# Altium schematic sheet Opamp_AH.SchDoc
size A4; CompanyName: Technische Hochschule Nürnberg Georg Simon Ohm; Organization: UltraZohm; Address1: Kesslerplatz 12; Address2: 90489 Nürnberg; Address3: GERMANY; DocumentNumber: 5; SheetNumber: 5; SheetTotal: 12; Website: www.ultrazohm.com
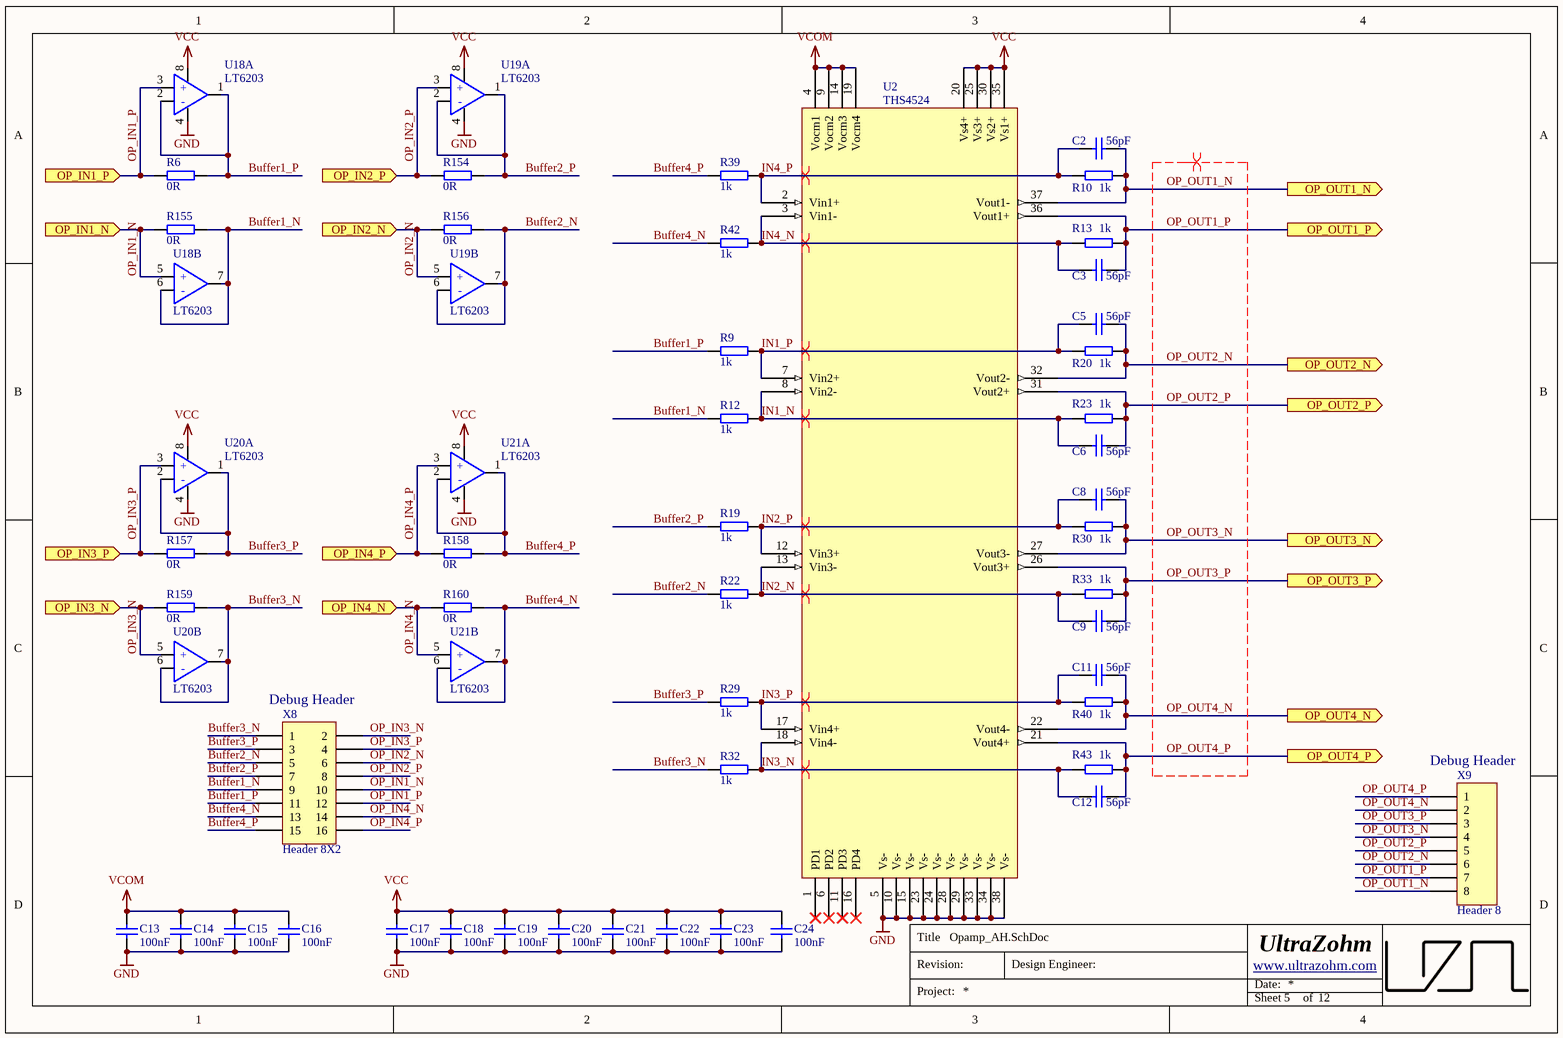
[diagram p0: Opamp_AH.SchDoc]

## Parts
C2  56pF  [CAPC1608X07N]
C3  56pF  [CAPC1608X07N]
C5  56pF  [CAPC1608X07N]
C6  56pF  [CAPC1608X07N]
C8  56pF  [CAPC1608X07N]
C9  56pF  [CAPC1608X07N]
C11  56pF  [CAPC1608X07N]
C12  56pF  [CAPC1608X07N]
C13  100nF  [CAPC1608X07N]
C14  100nF  [CAPC1608X07N]
C15  100nF  [CAPC1608X07N]
C16  100nF  [CAPC1608X07N]
C17  100nF  [CAPC1608X07N]
C18  100nF  [CAPC1608X07N]
C19  100nF  [CAPC1608X07N]
C20  100nF  [CAPC1608X07N]
C21  100nF  [CAPC1608X07N]
C22  100nF  [CAPC1608X07N]
C23  100nF  [CAPC1608X07N]
C24  100nF  [CAPC1608X07N]
R6  0R  [RESC1608X06N]
R9  1k  [RESC1608X06N]
R10  1k  [RESC1608X06N]
R12  1k  [RESC1608X06N]
R13  1k  [RESC1608X06N]
R19  1k  [RESC1608X06N]
R20  1k  [RESC1608X06N]
R22  1k  [RESC1608X06N]
R23  1k  [RESC1608X06N]
R29  1k  [RESC1608X06N]
R30  1k  [RESC1608X06N]
R32  1k  [RESC1608X06N]
R33  1k  [RESC1608X06N]
R39  1k  [RESC1608X06N]
R40  1k  [RESC1608X06N]
R42  1k  [RESC1608X06N]
R43  1k  [RESC1608X06N]
R154  0R  [RESC1608X06N]
R155  0R  [RESC1608X06N]
R156  0R  [RESC1608X06N]
R157  0R  [RESC1608X06N]
R158  0R  [RESC1608X06N]
R159  0R  [RESC1608X06N]
R160  0R  [RESC1608X06N]
U2  THS4524  [TSSOP38]
U18  LT6203  [8-MSOP]  (parts A,B of 2)
U19  LT6203  [8-MSOP]  (parts A,B of 2)
U20  LT6203  [8-MSOP]  (parts A,B of 2)
U21  LT6203  [8-MSOP]  (parts A,B of 2)
X8  Header 8X2  [HDR2X8]
X9  Header 8  [HDR1X8]

## Ports
OP_IN1_N (in), OP_IN1_P (in), OP_IN2_N (in), OP_IN2_P (in), OP_IN3_N (in), OP_IN3_P (in), OP_IN4_N (in), OP_IN4_P (in), OP_OUT1_N (out), OP_OUT1_P (out), OP_OUT2_N (out), OP_OUT2_P (out), OP_OUT3_N (out), OP_OUT3_P (out), OP_OUT4_N (out), OP_OUT4_P (out)

## Nets
GND: C13.2 C14.2 C15.2 C16.2 C17.2 C18.2 C19.2 C20.2 C21.2 C22.2 C23.2 C24.2 U2.5(Vs-) U2.10(Vs-) U2.15(Vs-) U2.23(Vs-) U2.24(Vs-) U2.28(Vs-) U2.29(Vs-) U2.33(Vs-) U2.34(Vs-) U2.38(Vs-) U18.4 U19.4 U20.4 U21.4
VCC: C17.1 C18.1 C19.1 C20.1 C21.1 C22.1 C23.1 C24.1 U2.20(Vs4+) U2.25(Vs3+) U2.30(Vs2+) U2.35(Vs1+) U18.8 U19.8 U20.8 U21.8
VCOM: C13.1 C14.1 C15.1 C16.1 U2.4(Vocm1) U2.9(Vocm2) U2.14(Vocm3) U2.19(Vocm4)
Buffer1_N: R12.2 R155.2 U18.6(-) U18.7 X8.9
Buffer1_P: R6.2 R9.1 U18.1 U18.2(-) X8.11
Buffer2_N: R22.2 R156.2 U19.6(-) U19.7 X8.5
Buffer2_P: R19.1 R154.2 U19.1 U19.2(-) X8.7
Buffer3_N: R32.2 R159.2 U20.6(-) U20.7 X8.1
Buffer3_P: R29.1 R157.2 U20.1 U20.2(-) X8.3
Buffer4_N: R42.2 R160.2 U21.6(-) U21.7 X8.13
Buffer4_P: R39.1 R158.2 U21.1 U21.2(-) X8.15
IN1_N: C6.1 R12.1 R23.1 U2.8(Vin2-)
IN1_P: C5.1 R9.2 R20.1 U2.7(Vin2+)
IN2_N: C9.1 R22.1 R33.1 U2.13(Vin3-)
IN2_P: C8.1 R19.2 R30.1 U2.12(Vin3+)
IN3_N: C12.1 R32.1 R43.1 U2.18(Vin4-)
IN3_P: C11.1 R29.2 R40.1 U2.17(Vin4+)
IN4_N: C3.1 R13.1 R42.1 U2.3(Vin1-)
IN4_P: C2.1 R10.1 R39.2 U2.2(Vin1+)
OP_IN1_N: R155.1 U18.5(+) X8.10 ; port OP_IN1_N
OP_IN1_P: R6.1 U18.3(+) X8.12 ; port OP_IN1_P
OP_IN2_N: R156.1 U19.5(+) X8.6 ; port OP_IN2_N
OP_IN2_P: R154.1 U19.3(+) X8.8 ; port OP_IN2_P
OP_IN3_N: R159.1 U20.5(+) X8.2 ; port OP_IN3_N
OP_IN3_P: R157.1 U20.3(+) X8.4 ; port OP_IN3_P
OP_IN4_N: R160.1 U21.5(+) X8.14 ; port OP_IN4_N
OP_IN4_P: R158.1 U21.3(+) X8.16 ; port OP_IN4_P
OP_OUT1_N: C2.2 R10.2 U2.37(Vout1-) X9.8 ; port OP_OUT1_N
OP_OUT1_P: C3.2 R13.2 U2.36(Vout1+) X9.7 ; port OP_OUT1_P
OP_OUT2_N: C5.2 R20.2 U2.32(Vout2-) X9.6 ; port OP_OUT2_N
OP_OUT2_P: C6.2 R23.2 U2.31(Vout2+) X9.5 ; port OP_OUT2_P
OP_OUT3_N: C8.2 R30.2 U2.27(Vout3-) X9.4 ; port OP_OUT3_N
OP_OUT3_P: C9.2 R33.2 U2.26(Vout3+) X9.3 ; port OP_OUT3_P
OP_OUT4_N: C11.2 R40.2 U2.22(Vout4-) X9.2 ; port OP_OUT4_N
OP_OUT4_P: C12.2 R43.2 U2.21(Vout4+) X9.1 ; port OP_OUT4_P

Not connected (* = marked no-connect by the designer): U2 1(PD1)* 6(PD2)* 11(PD3)* 16(PD4)*

## Layout directives
differential pair: IN1_N, IN1_P, IN2_N, IN2_P, IN3_N, IN3_P, IN4_N, IN4_P, OP_OUT1_N, OP_OUT1_P, OP_OUT2_N, OP_OUT2_P, OP_OUT3_N, OP_OUT3_P, OP_OUT4_N, OP_OUT4_P

## Notes on the sheet
- (near X8) Debug Header
- (near X9) Debug Header
- Title
- Revision:
- Design Engineer:
- Date:
- Project:
- Sheet
- of

## Library data of the parts
C2 C3 C5 C6 C8 C9 C11 C12 = Cap_0603: MPN: VJ0603A560JXACW1BC; MF: Vishay; Voltage: 50V; Value: 56pF; Supplier 1: Mouser; Supplier 2: *; Supplier Part Number 1: 77-VJ0603A560JXACBC; Supplier Part Number 2: *
C13-C24 = Cap_0603: MPN: 885012206071; MF: Würth; Voltage: 25V; Value: 100nF; Supplier 1: Mouser; Supplier 2: *; Supplier Part Number 1: 710-885012206071; Supplier Part Number 2: *
R6 R154-R160 = R_0603: MPN: CRCW06030000Z0EAC; MF: Vishay; Value: 0R; Supplier 1: Mouser; Supplier Part Number 1: 71-CRCW06030000Z0EAC
R9 R10 R12 R13 R19 R20 R22 R23 R29 R30 R33 R39 R40 R42 R43 = R_0603: MPN: RC0603FR-071KL; MF: Yageo; Value: 1k; Supplier 1: Mouser; Supplier Part Number 1: 603-RC0603FR-071KL
R32 = R_0603: MPN: RC0603FR-071KL; Case_EIA: 0603; MF: Yageo; Value: 1k; Supplier 1: Mouser; Supplier Part Number 1: 603-RC0603FR-071KL
U2 = THS4521: MPN: THS4524IDBTR; MF: Texas Instruments; Package: TSSOP-38; Supplier 1: Farnell; Supplier 2: Mouser; Supplier 3: Digi-Key; Supplier Part Number 1: 2496350; Supplier Part Number 2: 595-THS4524IDBTR; Supplier Part Number 3: 296-24315-1-ND
U18-U21 = LT6203: IC OPAMP GP 2 CIRCUIT 8MSOP; MPN: LT6203CMS8#PBF; MF: Analog Devices; Supplier Part Number 2: LT6203CMS8#PBF-ND; Supplier 1: Mouser; Supplier 2: Digi-Key; Supplier Part Number 1: 584-LT6203CMS8#PBF; Package: MSOP-8
X8 = Header 8X2: Header, 8-Pin, Dual row; LatestRevisionDate: 17-Jul-2002; LatestRevisionNote: Re-released for DXP Platform.; Publisher: Altium Limited
X9 = Header 8: Header, 8-Pin; LatestRevisionDate: 17-Jul-2002; LatestRevisionNote: Re-released for DXP Platform.; Publisher: Altium Limited